# Altium project Inverter_Control.PrjPcb (part 4 of 4)

## Sheet [6] Extras.SchDoc
size A4
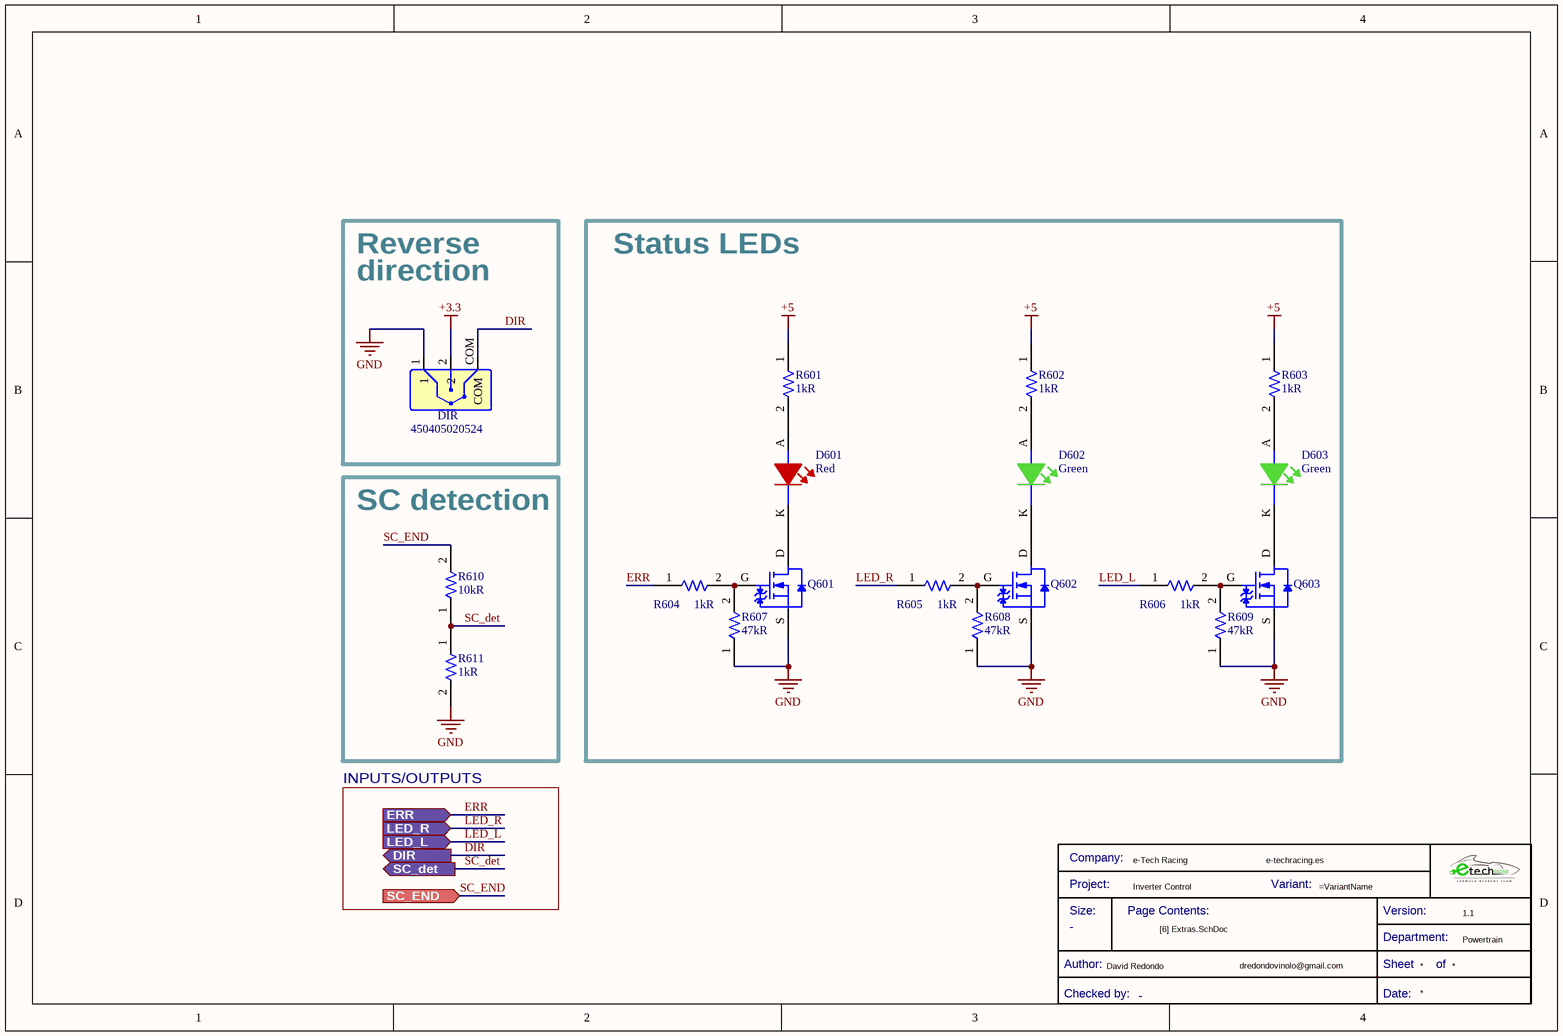
[diagram p6: [6] Extras.SchDoc]

### Parts
(Parts that share a designator on the sheet are numbered #1, #2 ... from top to bottom, then left to right.)
*?#5  Title Block_template  (value not drawn)  (graphical)
D601  Color: Red  [LED_0805_WE]  (hidden comment: 150080RS75000)
D602  Color: Green  [LED_0805_WE]  (hidden comment: 150080GS75000)
D603  Color: Green  [LED_0805_WE]  (hidden comment: 150080GS75000)
DIR  450405020524  [450405020524]
Q601  CPH3455-TL-H  [TRT-NCH-3/35-CPH]  (value not drawn)
Q602  CPH3455-TL-H  [TRT-NCH-3/35-CPH]  (value not drawn)
Q603  CPH3455-TL-H  [TRT-NCH-3/35-CPH]  (value not drawn)
R601  Resistance: 1kR  [R0805FTK]  (hidden comment: CR0805-JW-102ELF)
R602  Resistance: 1kR  [R0805FTK]  (hidden comment: CR0805-JW-102ELF)
R603  Resistance: 1kR  [R0805FTK]  (hidden comment: CR0805-JW-102ELF)
R604  Resistance: 1kR  [R0805FTK]  (hidden comment: CR0805-JW-102ELF)
R605  Resistance: 1kR  [R0805FTK]  (hidden comment: CR0805-JW-102ELF)
R606  Resistance: 1kR  [R0805FTK]  (hidden comment: CR0805-JW-102ELF)
R607  47kR  [R0805FTK]
R608  47kR  [R0805FTK]
R609  47kR  [R0805FTK]
R610  Resistance: 10kR  [R0805FTK]  (hidden comment: CR0805-JW-103ELF)
R611  Resistance: 1kR  [R0805FTK]  (hidden comment: CR0805-JW-102ELF)

### Blocks framed on the sheet
Status LEDs: D601-D603 Q601-Q603 R601-R609
SC detection: R610 R611

### Ports
DIR (out), ERR (in), LED_L (in), LED_R (in), SC_det (out), SC_END (in)

### Nets
+3.3: DIR.2
+5: R601.1 R602.1 R603.1
GND: DIR.1 Q601.S Q602.S Q603.S R607.1 R608.1 R609.1 R611.2
DIR: DIR.COM ; port DIR
ERR: R604.1 ; port ERR
LED_L: R606.1 ; port LED_L
LED_R: R605.1 ; port LED_R
SC_det: R610.1 R611.1 ; port SC_det
SC_END: R610.2 ; port SC_END
NetD601_A: D601.A R601.2
NetD601_K: D601.K Q601.D
NetD602_A: D602.A R602.2
NetD602_K: D602.K Q602.D
NetD603_A: D603.A R603.2
NetD603_K: D603.K Q603.D
NetQ601_G: Q601.G R604.2 R607.2
NetQ602_G: Q602.G R605.2 R608.2
NetQ603_G: Q603.G R606.2 R609.2

### Notes on the sheet
- Reverse
- direction
- INPUTS/OUTPUTS
- (in symbol Title Block_template) Company:; Project:; Variant:; Size:; Page Contents:; Version:; Department:; Author:; Sheet; of; Checked by:; Date:

### Library data of the parts
*?#5 = Title Block_template: Standard Title Block; .Creator: GP; Category: Title Block; .PCBcheck: GP; .SCHcheck: GP; Checked by:: -; Size: -
D601 = LEDRS-0805-150: 0805(H=0.8mm) 红色 高亮 λD=625nm VF=2V IF=30mA PD=72mW; Manufacturer 1: Wurth Electronics; Luminous Intensity: 150mcd; Viewing Angle: 140°; Forward Voltage: 2V; Wavelength: 625nm; Lens Style: Clear,Rectangular; Forward Current: 30mA; Test Current: 20mA; .Creator: DR; ComponentLink1Description: Datasheet; ComponentLink1URL: https://www.we-online.com/catalog/datasheet/150080RS75000.pdf; ComponentLink2Description: Where buy it; ComponentLink2URL: https://katalog.we-online.de/en/led/WL-SMCW/150080RS75000; Supplier 1: RSComponents; Manufacturer Part Number 1: 150080RS75000; RoHS: Yes; Category: LEDs; Stock 1: 1; Pricing 1: 50=0,19300, 500=0,12900, 1000=0,12300, 2000=0,11700, 4000=0,11100 (USD); Mount: Surface Mount; Case/Package: 0805; Case Code (Metric): 2012; Case Code (Imperial): 0805; Min Operating Temperature: -40°C; Max Operating Temperature: 85°C; Package Quantity: 4000; Packaging: Tape and Reel; Dominant Wavelength: 625nm; Length: 2mm; Width: 1.25mm; Height: 0.7mm; REACH SVHC: Unknown; RoHS Compliant: Yes; ComponentLink3URL: https://datasheet.ciiva.com/22656/150080rs75000-22656961.pdf?src-supplier=Element14; ComponentLink3Description: https://datasheet.ciiva.com/22656/150080rs75000-22656961.pdf?src-supplier=Element14; ComponentLink4URL: https://datasheet.ciiva.com/29279/759435-da-01-en-chipled-0805-w-kl-rot-150080rs75000-29279032.pdf?src-supplier=Conrad; ComponentLink4Description: https://datasheet.ciiva.com/29279/759435-da-01-en-chipled-0805-w-kl-rot-150080rs75000-29279032.pdf?src-supplier=Conrad; Supplier Part Number 1: 8154225P
D602 D603 = LEDGS-0805-450: Led, Green, 520 Nm, 3.2 V, 30 Ma, 450 Mcd Rohs Compliant: Yes; Manufacturer 1: Wurth Electronics; Viewing Angle: 140°; Lens Style: Clear,Rectangular; Luminous Intensity: 450mcd; Forward Voltage: 3.2V; Wavelength: 520nm; Forward Current: 30mA; Test Current: 20mA; .Creator: GP; ComponentLink1Description: Datasheet; ComponentLink1URL: https://www.we-online.com/catalog/datasheet/150080GS75000.pdf; ComponentLink2Description: Where buy it; ComponentLink2URL: https://katalog.we-online.de/en/led/WL-SMCW/150080GS75000; Supplier 1: RSComponents; Manufacturer Part Number 1: 150080GS75000; RoHS: Yes; Category: LEDs; Stock 1: 4350; Pricing 1: 50=0,19300, 500=0,12900, 1000=0,12300, 2000=0,11700, 4000=0,11100 (USD); Mount: Surface Mount; Case/Package: 0805; Case Code (Metric): 2012; Case Code (Imperial): 0805; Min Operating Temperature: -40°C; Max Operating Temperature: 85°C; Package Quantity: 4000; Packaging: Cut Tape; Dominant Wavelength: 520nm; Length: 2mm; Width: 1.25mm; Height: 0.7mm; REACH SVHC: Unknown; RoHS Compliant: Yes; ComponentLink3URL: https://datasheet.ciiva.com/29563/150080gs75000-29563008.pdf?src-supplier=Digi-Key; ComponentLink3Description: https://datasheet.ciiva.com/29563/150080gs75000-29563008.pdf?src-supplier=Digi-Key; ComponentLink4URL: https://datasheet.ciiva.com/29279/759434-da-01-en-chipled-0805-w-kl-gruen-150080gs75000-29279039.pdf?src-supplier=Conrad; ComponentLink4Description: https://datasheet.ciiva.com/29279/759434-da-01-en-chipled-0805-w-kl-gruen-150080gs75000-29279039.pdf?src-supplier=Conrad; Supplier Part Number 1: 8154221
DIR = 450405020524: WS-SLSU Mini Slide Switch; Manufacturer: Wurth Electronics; Supplier: Mouser; Supplier Part Number: 710-450405020524; Manufacturer Part Number: 450405020524; RoHS: No; Category: Uncategorized; Stock: 2050; Pricing: 1=1,01, 10=1,01, 50=0,947, 100=0,906, 1000=0,747, 10000=0,746 (USD); ComponentLink1Description: Datasheet; ComponentLink1URL: https://www.we-online.com/components/products/datasheet/450405020524.pdf
Q601-Q603 = TRT-NCH-3/35-CPH: CPH3455-TL-H N-channel MOSFET Transistor; 3 A; 35 V; 3-Pin CPH; Manufacturer: ON Semiconductor; Rds On Max: 104mR; Input Capacitance: 186pF; Rise Time: 4.7ns; Drain to Source Voltage (Vdss): 35V; Continuous Drain Current (ID): 3A; Max Power Dissipation: 1W; Drain to Source Resistance: 108mR; Turn-On Delay Time: 4.2ns; Turn-Off Delay Time: 15ns; Fall Time: 5.7ns; Element Configuration: Single; Gate to Source Voltage (Vgs): 20V; .Creator: GP; Category: Transistor; ComponentLink1Description: Datasheet; ComponentLink1URL: https://docs.rs-online.com/5847/0900766b812d514d.pdf; ComponentLink2Description: Where buy it; ComponentLink2URL: https://es.rs-online.com/web/p/mosfet/8009989; Supplier 1: RSComponents; Manufacturer Part Number: CPH3455-TL-H; RoHS: Yes; Stock 1: 1; Pricing 1: 50=0,50400 (USD); Case/Package: SC; Number of Pins: 3; Min Operating Temperature: -55°C; Max Operating Temperature: 150°C; Package Quantity: 3000; Packaging: Tape and Reel; Drain to Source Breakdown Voltage: 35V; Power Dissipation: 1W; Polarity: N-CHANNEL; Series: -; Length: 2.9mm; Width: 1.6mm; Height: 0.9mm; Lead Free: Lead Free; Halogen Free: Halogen Free; RoHS Compliant: Yes; ComponentLink3URL: https://datasheet.ciiva.com/947/cph3455-d-947201.pdf?src-supplier=Digi-Key; ComponentLink3Description: https://datasheet.ciiva.com/947/cph3455-d-947201.pdf?src-supplier=Digi-Key; ComponentLink4URL: https://datasheet.ciiva.com/4444/cph3455-d-91653-4444616.pdf?src-supplier=Mouser; ComponentLink4Description: https://datasheet.ciiva.com/4444/cph3455-d-91653-4444616.pdf?src-supplier=Mouser; ComponentLink5URL: https://datasheet.ciiva.com/11164/cph3455-d-11164889.pdf?src-supplier=Avnet; ComponentLink5Description: https://datasheet.ciiva.com/11164/cph3455-d-11164889.pdf?src-supplier=Avnet; Supplier Part Number 1: 8009989
R601-R606 R611 = R1k-0805FTK: Res Thick Film 0805 1K Ohm 5% 1/8W ±200ppm/°C Molded SMD SMD Paper Tape on Plastic Reel; Manufacturer 1: Bourns; Voltage Rating (DC): 150V; Power Rating: 125mW; .Creator: GP; Supplier 1: Arrow Electronics; Manufacturer Part Number 1: CR0805-JW-102ELF; RoHS: Yes; Category: Chip SMD Resistors; Stock 1: 27510; Pricing 1: 1=0,05930, 10=0,03510, 25=0,01790, 100=0,00800, 250=0,00790, 500=0,00590, 1000=0,00360, 3000=0,00350, 6000=0,00250 (USD); Mount: Surface Mount; Case/Package: 0805; Number of Pins: 2; Contact Plating: Tin; Case Code (Metric): 2012; Case Code (Imperial): 0805; Min Operating Temperature: -55°C; Max Operating Temperature: 155°C; Resistor Type: Thick Film; Tolerance: 5%; Temperature Coefficient: 200ppm/°C; Features: Moisture Resistant; Package Quantity: 1; Packaging: Tape and Reel; Voltage Rating: 150V; Number of Terminations: 2; Termination: SMD/SMT; Max Power Dissipation: 125mW; Length: 2mm; Width: 1.25mm; Height: 0.5mm; Thickness: 508um; Depth: 1.25mm; Radiation Hardening: No; Lead Free: Lead Free; REACH SVHC: No SVHC; Military Standard: Not; ComponentLink1URL: https://datasheet.ciiva.com/11821/0900766b80fcdb72-11821134.pdf?src-supplier=RSComponents; ComponentLink1Description: https://datasheet.ciiva.com/11821/0900766b80fcdb72-11821134.pdf?src-supplier=RSComponents; ComponentLink2URL: https://datasheet.ciiva.com/15225/getdatasheetpartid-78155-15225381.pdf?src-supplier=Verical; ComponentLink2Description: https://datasheet.ciiva.com/15225/getdatasheetpartid-78155-15225381.pdf?src-supplier=Verical; ComponentLink3URL: https://datasheet.ciiva.com/22693/1902866-22693253.pdf?src-supplier=Element14; ComponentLink3Description: https://datasheet.ciiva.com/22693/1902866-22693253.pdf?src-supplier=Element14; ComponentLink4URL: https://datasheet.ciiva.com/7986/1856384-7986184.pdf?src-supplier=Element14; ComponentLink4Description: https://datasheet.ciiva.com/7986/1856384-7986184.pdf?src-supplier=Element14; ComponentLink5URL: https://datasheet.ciiva.com/7985/1856384-7985867.pdf?src-supplier=Element14; ComponentLink5Description: https://datasheet.ciiva.com/7985/1856384-7985867.pdf?src-supplier=Element14; ComponentLink6URL: https://datasheet.ciiva.com/30242/159chpreztr-30242765.pdf?src-supplier=Onlinecomponents.com; ComponentLink6Description: https://datasheet.ciiva.com/30242/159chpreztr-30242765.pdf?src-supplier=Onlinecomponents.com; ComponentLink7URL: https://datasheet.ciiva.com/6547/chpreztr-6547359.pdf?src-supplier=Digi-Key; ComponentLink7Description: https://datasheet.ciiva.com/6547/chpreztr-6547359.pdf?src-supplier=Digi-Key; Supplier Part Number 1: CR0805-JW-102ELF
R607-R609 = R47kR-0805FTK
R610 = R10k-0805FTK: BOURNS         CR0805-JW-103ELF            Surface Mount Chip Resistor, Thick Film, CR Series, 10 kohm, 125 mW,  5%, 150 V; Temperature Coefficient: 200ppm/°C; Power Rating: 125mW; Voltage Rating: 150V; Voltage Rating (DC): 100V; .Creator: DR; Supplier 1: Arrow Electronics; Manufacturer 1: Bourns; Manufacturer Part Number 1: CR0805-JW-103ELF; RoHS: Yes; Category: Chip SMD Resistors; Stock 1: 57566; Pricing 1: 1=0,05790, 10=0,01540, 25=0,01340, 100=0,00340 (USD); Mount: Surface Mount; Case/Package: 0805; Number of Pins: 2; Contact Plating: Tin; Case Code (Metric): 2012; Case Code (Imperial): 0805; Min Operating Temperature: -55°C; Max Operating Temperature: 155°C; Tolerance: 5%; Resistor Type: Thick Film; Package Quantity: 1; Packaging: Tape and Reel; Number of Terminations: 2; Termination: SMD/SMT; Max Power Dissipation: 125mW; Features: Moisture Resistant; Series: CR0805; Construction: Rectangular; Resistance Tolerance: 5%; Technology: THICK FILM; Length: 2mm; Width: 1.25mm; Height: 0.5mm; Depth: 1.25mm; Thickness: 508um; Radiation Hardening: No; REACH SVHC: No SVHC; Military Standard: Not; RoHS Compliant: Yes; ComponentLink1URL: https://datasheet.ciiva.com/11821/0900766b80fcdb72-11821135.pdf?src-supplier=RSComponents; ComponentLink1Description: https://datasheet.ciiva.com/11821/0900766b80fcdb72-11821135.pdf?src-supplier=RSComponents; ComponentLink2URL: https://datasheet.ciiva.com/9122/chpreztr-9122374.pdf?src-supplier=Avnet; ComponentLink2Description: https://datasheet.ciiva.com/9122/chpreztr-9122374.pdf?src-supplier=Avnet; ComponentLink3URL: https://datasheet.ciiva.com/22693/1902866-22693254.pdf?src-supplier=Element14; ComponentLink3Description: https://datasheet.ciiva.com/22693/1902866-22693254.pdf?src-supplier=Element14; ComponentLink4URL: https://datasheet.ciiva.com/7986/691949-7986187.pdf?src-supplier=Element14; ComponentLink4Description: https://datasheet.ciiva.com/7986/691949-7986187.pdf?src-supplier=Element14; ComponentLink5URL: https://datasheet.ciiva.com/30065/159chpreztr-30065976.pdf?src-supplier=Onlinecomponents.com; ComponentLink5Description: https://datasheet.ciiva.com/30065/159chpreztr-30065976.pdf?src-supplier=Onlinecomponents.com; ComponentLink6URL: https://datasheet.ciiva.com/16783/70154685-16783482.pdf?src-supplier=Allied+Electronics; ComponentLink6Description: https://datasheet.ciiva.com/16783/70154685-16783482.pdf?src-supplier=Allied+Electronics; ComponentLink7URL: https://datasheet.ciiva.com/5548/chpreztr-5548491.pdf?src-supplier=Mouser; ComponentLink7Description: https://datasheet.ciiva.com/5548/chpreztr-5548491.pdf?src-supplier=Mouser; ComponentLink8URL: https://datasheet.ciiva.com/6559/chpreztr-6559900.pdf?src-supplier=Digi-Key; ComponentLink8Description: https://datasheet.ciiva.com/6559/chpreztr-6559900.pdf?src-supplier=Digi-Key; ComponentLink9URL: https://datasheet.ciiva.com/6559/chpreztr-6559901.pdf?src-supplier=Digi-Key; ComponentLink9Description: https://datasheet.ciiva.com/6559/chpreztr-6559901.pdf?src-supplier=Digi-Key; ComponentLink10URL: https://datasheet.ciiva.com/7985/1856384-7985869.pdf?src-supplier=Element14; ComponentLink10Description: https://datasheet.ciiva.com/7985/1856384-7985869.pdf?src-supplier=Element14; ComponentLink11URL: https://datasheet.ciiva.com/48692/001055517-da-01-en-smd-wid-cr0805-jw-103elf-10k-ohm-1-8w-48692118.pdf?src-supplier=Conrad; ComponentLink11Description: https://datasheet.ciiva.com/48692/001055517-da-01-en-smd-wid-cr0805-jw-103elf-10k-ohm-1-8w-48692118.pdf?src-supplier=Conrad; Supplier Part Number 1: CR0805-JW-103ELF

## Nets that join several sheets
+3.3: [2] MCU (32 pins), [1] Supply (5 pins), L (6 pins), R (6 pins), [6] Extras (DIR.2)
+5: [1] Supply (7 pins), [3] CAN (5 pins), L (C409_L.2 C410_L.2 Feedback_L.7 U401_L.3), R (C409_R.2 C410_R.2 Feedback_R.7 U401_R.3), L (PWR_L.23 PWR_L.24 R501_L.2 U501_L.7), [6] Extras (R601.1 R602.1 R603.1), R (PWR_R.23 PWR_R.24 R501_R.2 U501_R.7)
GND: Inverter_Control (J1.6 MP_L.1 MP_R.1), [2] MCU (46 pins), [1] Supply (29 pins), [3] CAN (14 pins), L (12 pins), R (12 pins), L (12 pins), [6] Extras (8 pins), R (12 pins)
A: [2] MCU (TP259.1 U201.59), L (C406_L.2 R406_L.1 U401_L.14)
A: [2] MCU (TP277.1 U201.77), R (C406_R.2 R406_R.1 U401_R.14)
B: [2] MCU (TP246.1 U201.46), R (C404_R.2 R404_R.1 U401_R.1)
B: [2] MCU (TP261.1 U201.61), L (C404_L.2 R404_L.1 U401_L.1)
CAN1_H: Inverter_Control (J1.3), [3] CAN (5 pins)
CAN1_L: Inverter_Control (J1.2), [3] CAN (5 pins)
CAN1_RX: [2] MCU (TP281.1 U201.81), [3] CAN (R307.1 U301.4)
CAN1_TX: [2] MCU (TP282.1 U201.82), [3] CAN (R304.1 U301.1)
DIR: [2] MCU (TP284.1 U201.84), [6] Extras (DIR.COM)
ENABLE: [2] MCU (TP236.1 U201.36), R (PWR_R.5)
ENABLE: [2] MCU (TP237.1 U201.37), L (PWR_L.5)
ERR: [2] MCU (TP287.1 U201.87), [6] Extras (R604.1)
ia: [2] MCU (TP222.1 U201.22), R (C501_R.2 R503_R.2 R602_R.1)
ia: [2] MCU (TP230.1 U201.30), L (C501_L.2 R503_L.2 R602_L.1)
ib: [2] MCU (TP223.1 U201.23), R (C502_R.2 R505_R.2 R604_R.1)
ib: [2] MCU (TP231.1 U201.31), L (C502_L.2 R505_L.2 R604_L.1)
ic: [2] MCU (TP224.1 U201.24), R (C503_R.2 R507_R.2 R606_R.1)
ic: [2] MCU (TP234.1 U201.34), L (C503_L.2 R507_L.2 R606_L.1)
LED_L: [2] MCU (TP285.1 U201.85), [6] Extras (R606.1)
LED_R: [2] MCU (TP286.1 U201.86), [6] Extras (R605.1)
LV+ in: Inverter_Control (J1.4), [1] Supply (D101.2 D102.A TP101.1)
PWM1: [2] MCU (PWM1_R.1 U201.29), R (PWR_R.11)
PWM1: [2] MCU (PWM1_L.1 U201.38), L (PWR_L.11)
PWM2: [2] MCU (PWM2_L.1 U201.39), L (PWR_L.12)
PWM2: [2] MCU (PWM2_R.1 U201.63), R (PWR_R.12)
PWM3: [2] MCU (PWM3_L.1 U201.40), L (PWR_L.13)
PWM3: [2] MCU (PWM3_R.1 U201.53), R (PWR_R.13)
PWM4: [2] MCU (PWM4_L.1 U201.41), L (PWR_L.14)
PWM4: [2] MCU (PWM4_R.1 U201.64), R (PWR_R.14)
PWM5: [2] MCU (PWM5_L.1 U201.42), L (PWR_L.15)
PWM5: [2] MCU (PWM5_R.1 U201.54), R (PWR_R.15)
PWM6: [2] MCU (PWM6_L.1 U201.43), L (PWR_L.16)
PWM6: [2] MCU (PWM6_R.1 U201.65), R (PWR_R.16)
SC_det: [2] MCU (TP232.1 U201.32), [6] Extras (R610.1 R611.1)
SC_END: Inverter_Control (J1.8), L (PWR_L.20), [6] Extras (R610.2), R (PWR_R.20)
Tinv: [2] MCU (TP215.1 U201.15), L (R607_L.2 R608_L.2 R609_L.2)
Tinv: [2] MCU (TP216.1 U201.16), R (R607_R.2 R608_R.2 R609_R.2)
Tmot: [2] MCU (TP217.1 U201.17), L (R409_L.2 R410_L.2)
Tmot: [2] MCU (TP218.1 U201.18), R (R409_R.2 R410_R.2)
TRIP: [2] MCU (TP267.1 U201.67), L (PWR_L.9)
TRIP: [2] MCU (TP266.1 U201.66), R (PWR_R.9)
TSAL_ON: Inverter_Control (J1.7), L (PWR_L.22), R (PWR_R.22)
USB_VBUS: [2] MCU (R201.2 TVS1.5 USB.1), [1] Supply (5 pins)
VDC: [2] MCU (TP225.1 U201.25), R (U501_R.6)
VDC: [2] MCU (TP235.1 U201.35), L (U501_L.6)
WRN: [2] MCU (TP244.1 U201.44), L (U401_L.13)
WRN: [2] MCU (TP245.1 U201.45), R (U401_R.13)
Z: [2] MCU (TP247.1 U201.47), R (C402_R.2 R402_R.1 U401_R.2)
Z: [2] MCU (TP262.1 U201.62), L (C402_L.2 R402_L.1 U401_L.2)

## Assembly variants
Inverter_Control: not fitted C301 C302 C303 C304 C305 C408_L C408_R D301 D302 Q101 Q301 Q302 R204 R301 R302 R303 R304 R305 R306 R307 R308 R410_L R410_R R411_L R411_R R412_L R412_R R413_L R413_R R414_L R414_R R415_L R415_R R416_L R416_R R510_L R510_R R511_L R511_R; alternate parts R407_L -> R1k-0805FTK, R407_R -> R1k-0805FTK, R408_L -> R15-0805FTN, R408_R -> R15-0805FTN
All Components: all parts fitted